# EAGLE design 60W FM PA (EAGLE 9.6.2)
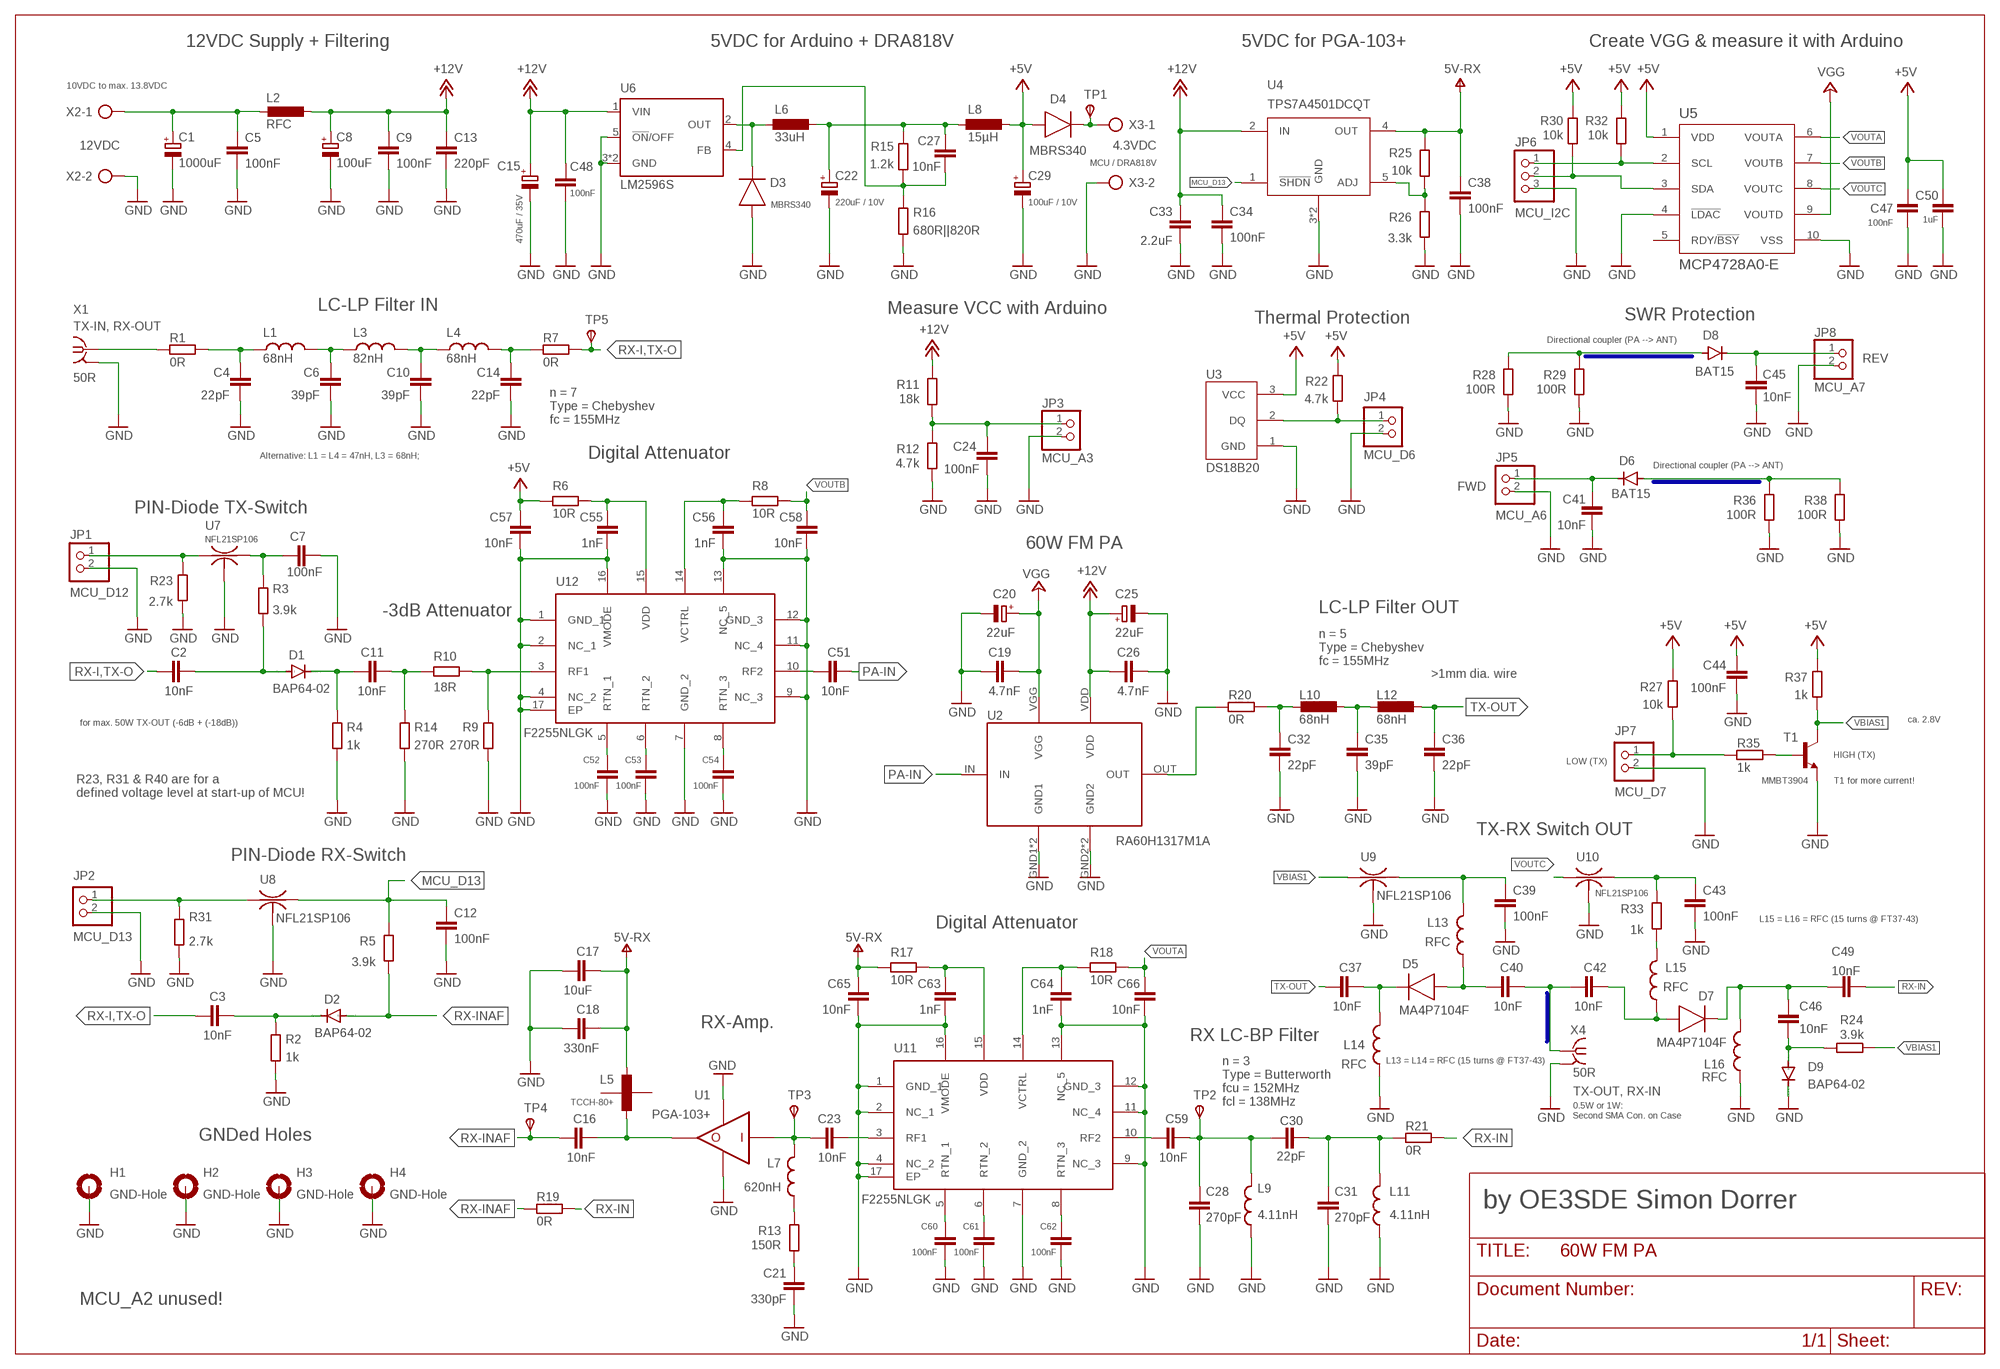
[diagram p0: schematic, sheet 1]

## Parts
C1  1000uF  C-POL_ECAP-10.5MM  [CAPAE1030X1050N]
C2  10nF  C_CHIP-0805(2012-METRIC)  [CAPC2012X110]
C3  10nF  C_CHIP-0805(2012-METRIC)  [CAPC2012X110]
C4  22pF  C_CHIP-0805(2012-METRIC)  [CAPC2012X110]
C5  100nF  C_CHIP-0805(2012-METRIC)  [CAPC2012X110]
C6  39pF  C_CHIP-0805(2012-METRIC)  [CAPC2012X110]
C7  100nF  C_CHIP-0805(2012-METRIC)  [CAPC2012X110]
C8  100uF  C-POL_ECAP-10.5MM  [CAPAE1030X1050N]
C9  100nF  C_CHIP-0805(2012-METRIC)  [CAPC2012X110]
C10  39pF  C_CHIP-0805(2012-METRIC)  [CAPC2012X110]
C11  10nF  C_CHIP-0805(2012-METRIC)  [CAPC2012X110]
C12  100nF  C_CHIP-0805(2012-METRIC)  [CAPC2012X110]
C13  220pF  C_CHIP-0805(2012-METRIC)  [CAPC2012X110]
C14  22pF  C_CHIP-0805(2012-METRIC)  [CAPC2012X110]
C15  470uF / 35V  C-POL_ECAP-10.5MM  [CAPAE1030X1050N]
C16  10nF  C_CHIP-0805(2012-METRIC)  [CAPC2012X110]
C17  10uF  C_CHIP-0805(2012-METRIC)  [CAPC2012X110]
C18  330nF  C_CHIP-0805(2012-METRIC)  [CAPC2012X110]
C19  4.7nF  C_CHIP-0805(2012-METRIC)  [CAPC2012X110]
C20  22uF  CPOL-EUSMCD  [SMC_D]
C21  330pF  C_CHIP-0805(2012-METRIC)  [CAPC2012X110]
C22  220uF / 10V  C-POL_TANTALUM-2917(7343-METRIC)  [CAPMP7343X310N]
C23  10nF  C_CHIP-0805(2012-METRIC)  [CAPC2012X110]
C24  100nF  C_CHIP-0805(2012-METRIC)  [CAPC2012X110]
C25  22uF  CPOL-EUSMCD  [SMC_D]
C26  4.7nF  C_CHIP-0805(2012-METRIC)  [CAPC2012X110]
C27  10nF  C_CHIP-0805(2012-METRIC)  [CAPC2012X110]
C28  270pF  C_CHIP-0805(2012-METRIC)  [CAPC2012X110]
C29  100uF / 10V  C-POL_TANTALUM-2917(7343-METRIC)  [CAPMP7343X310N]
C30  22pF  C_CHIP-0805(2012-METRIC)  [CAPC2012X110]
C31  270pF  C_CHIP-0805(2012-METRIC)  [CAPC2012X110]
C32  22pF  C_CHIP-1206(3216-METRIC)  [CAPC3216X135]
C33  2.2uF  C_CHIP-0805(2012-METRIC)  [CAPC2012X110]
C34  100nF  C_CHIP-0805(2012-METRIC)  [CAPC2012X110]
C35  39pF  C_CHIP-1206(3216-METRIC)  [CAPC3216X135]
C36  22pF  C_CHIP-1206(3216-METRIC)  [CAPC3216X135]
C37  10nF  C_CHIP-1206(3216-METRIC)  [CAPC3216X135]
C38  100nF  C_CHIP-0805(2012-METRIC)  [CAPC2012X110]
C39  100nF  C_CHIP-0805(2012-METRIC)  [CAPC2012X110]
C40  10nF  C_CHIP-1206(3216-METRIC)  [CAPC3216X135]
C41  10nF  C_CHIP-0805(2012-METRIC)  [CAPC2012X110]
C42  10nF  C_CHIP-1206(3216-METRIC)  [CAPC3216X135]
C43  100nF  C_CHIP-0805(2012-METRIC)  [CAPC2012X110]
C44  100nF  C_CHIP-0805(2012-METRIC)  [CAPC2012X110]
C45  10nF  C_CHIP-0805(2012-METRIC)  [CAPC2012X110]
C46  10nF  C_CHIP-0805(2012-METRIC)  [CAPC2012X110]
C47  100nF  C_CHIP-0805(2012-METRIC)  [CAPC2012X110]
C48  100nF  C_CHIP-0805(2012-METRIC)  [CAPC2012X110]
C49  10nF  C_CHIP-0805(2012-METRIC)  [CAPC2012X110]
C50  1uF  C_CHIP-0805(2012-METRIC)  [CAPC2012X110]
C51  10nF  C_CHIP-0805(2012-METRIC)  [CAPC2012X110]
C52  100nF  C_CHIP-0603(1608-METRIC)  [CAPC1608X85]
C53  100nF  C_CHIP-0603(1608-METRIC)  [CAPC1608X85]
C54  100nF  C_CHIP-0603(1608-METRIC)  [CAPC1608X85]
C55  1nF  C_CHIP-0805(2012-METRIC)  [CAPC2012X110]
C56  1nF  C_CHIP-0805(2012-METRIC)  [CAPC2012X110]
C57  10nF  C_CHIP-0805(2012-METRIC)  [CAPC2012X110]
C58  10nF  C_CHIP-0805(2012-METRIC)  [CAPC2012X110]
C59  10nF  C_CHIP-0805(2012-METRIC)  [CAPC2012X110]
C60  100nF  C_CHIP-0603(1608-METRIC)  [CAPC1608X85]
C61  100nF  C_CHIP-0603(1608-METRIC)  [CAPC1608X85]
C62  100nF  C_CHIP-0603(1608-METRIC)  [CAPC1608X85]
C63  1nF  C_CHIP-0805(2012-METRIC)  [CAPC2012X110]
C64  1nF  C_CHIP-0805(2012-METRIC)  [CAPC2012X110]
C65  10nF  C_CHIP-0805(2012-METRIC)  [CAPC2012X110]
C66  10nF  C_CHIP-0805(2012-METRIC)  [CAPC2012X110]
D1  BAP64-02  DIODE-SOD523  [SOD523]
D2  BAP64-02  DIODE-SOD523  [SOD523]
D3  MBRS340  DIODEDO-214AB(SMC)  [DIOM7959X625N]
D4  MBRS340  DIODEDO-214AB(SMC)  [DIOM7959X625N]
D5  MA4P7104F  DIODE_DO-221-AA  [SODFL5336X110]
D6  BAT15  1N4148WS  [SOD-323]
D7  MA4P7104F  DIODE_DO-221-AA  [SODFL5336X110]
D8  BAT15  1N4148WS  [SOD-323]
D9  BAP64-02  DIODE-SOD523  [SOD523]
H1  GND-Hole  MOUNT-PAD-ROUND3.0  [3,0-PAD]
H2  GND-Hole  MOUNT-PAD-ROUND3.0  [3,0-PAD]
H3  GND-Hole  MOUNT-PAD-ROUND3.0  [3,0-PAD]
H4  GND-Hole  MOUNT-PAD-ROUND3.0  [3,0-PAD]
JP1  MCU_D12  PINHD-1X2  [1X02]
JP2  MCU_D13  PINHD-1X2  [1X02]
JP3  MCU_A3  PINHD-1X2  [1X02]
JP4  MCU_D6  PINHD-1X2  [1X02]
JP5  MCU_A6  PINHD-1X2  [1X02]
JP6  MCU_I2C  PINHD-1X3  [1X03]
JP7  MCU_D7  PINHD-1X2  [1X02]
JP8  MCU_A7  PINHD-1X2  [1X02]
L1  68nH  L_CHIP-0805(2012-METRIC)  [INDC2009X120]
L2  RFC  T50-6  [T50-6SMD]
L3  82nH  L_CHIP-0805(2012-METRIC)  [INDC2009X120]
L4  68nH  L_CHIP-0805(2012-METRIC)  [INDC2009X120]
L5  TCCH-80+  [TCCH-80]
L6  33uH  L-EU  [1260]
L7  620nH  L_CHIP-0805(2012-METRIC)  [INDC2009X120]
L8  15µH  L-EU  [1260]
L9  4.11nH  L_CHIP-0805(2012-METRIC)  [INDC2009X120]
L10  68nH  T50-6  [T50-6SMD]
L11  4.11nH  L_CHIP-0805(2012-METRIC)  [INDC2009X120]
L12  68nH  T50-6  [T50-6SMD]
L13  RFC  L_CHIP-1206(3216-METRIC)  [INDC3216X190]
L14  RFC  L_CHIP-1206(3216-METRIC)  [INDC3216X190]
L15  RFC  L_CHIP-1206(3216-METRIC)  [INDC3216X190]
L16  RFC  L_CHIP-1206(3216-METRIC)  [INDC3216X190]
R1  0R  R_CHIP-0805(2012-METRIC)  [RESC2012X65]
R2  1k  R_CHIP-0805(2012-METRIC)  [RESC2012X65]
R3  3.9k  R_CHIP-0805(2012-METRIC)  [RESC2012X65]
R4  1k  R_CHIP-0805(2012-METRIC)  [RESC2012X65]
R5  3.9k  R_CHIP-0805(2012-METRIC)  [RESC2012X65]
R6  10R  R_CHIP-0805(2012-METRIC)  [RESC2012X65]
R7  0R  R_CHIP-0805(2012-METRIC)  [RESC2012X65]
R8  10R  R_CHIP-0805(2012-METRIC)  [RESC2012X65]
R9  270R  R_CHIP-0805(2012-METRIC)  [RESC2012X65]
R10  18R  R_CHIP-0805(2012-METRIC)  [RESC2012X65]
R11  18k  R_CHIP-0805(2012-METRIC)  [RESC2012X65]
R12  4.7k  R_CHIP-0805(2012-METRIC)  [RESC2012X65]
R13  150R  R_CHIP-0805(2012-METRIC)  [RESC2012X65]
R14  270R  R_CHIP-0805(2012-METRIC)  [RESC2012X65]
R15  1.2k  R_CHIP-0805(2012-METRIC)  [RESC2012X65]
R16  680R||820R  R_CHIP-0805(2012-METRIC)  [RESC2012X65]
R17  10R  R_CHIP-0805(2012-METRIC)  [RESC2012X65]
R18  10R  R_CHIP-0805(2012-METRIC)  [RESC2012X65]
R19  0R  R_CHIP-0805(2012-METRIC)  [RESC2012X65]
R20  0R  R_CHIP-1206(3216-METRIC)  [RESC3216X70]
R21  0R  R_CHIP-0805(2012-METRIC)  [RESC2012X65]
R22  4.7k  R_CHIP-0805(2012-METRIC)  [RESC2012X65]
R23  2.7k  R_CHIP-0805(2012-METRIC)  [RESC2012X65]
R24  3.9k  R_CHIP-0805(2012-METRIC)  [RESC2012X65]
R25  10k  R_CHIP-0805(2012-METRIC)  [RESC2012X65]
R26  3.3k  R_CHIP-0805(2012-METRIC)  [RESC2012X65]
R27  10k  R_CHIP-0805(2012-METRIC)  [RESC2012X65]
R28  100R  R_CHIP-0805(2012-METRIC)  [RESC2012X65]
R29  100R  R_CHIP-0805(2012-METRIC)  [RESC2012X65]
R30  10k  R_CHIP-0805(2012-METRIC)  [RESC2012X65]
R31  2.7k  R_CHIP-0805(2012-METRIC)  [RESC2012X65]
R32  10k  R_CHIP-0805(2012-METRIC)  [RESC2012X65]
R33  1k  R_CHIP-0805(2012-METRIC)  [RESC2012X65]
R35  1k  R_CHIP-0805(2012-METRIC)  [RESC2012X65]
R36  100R  R_CHIP-0805(2012-METRIC)  [RESC2012X65]
R37  1k  R_CHIP-0805(2012-METRIC)  [RESC2012X65]
R38  100R  R_CHIP-0805(2012-METRIC)  [RESC2012X65]
T1  MMBT3904  [SOT23]
TP1  TPSTP10SQ  [TP10SQ]
TP2  TPSTP10SQ  [TP10SQ]
TP3  TPSTP10SQ  [TP10SQ]
TP4  TPSTP10SQ  [TP10SQ]
TP5  TPSTP10SQ  [TP10SQ]
U1  PGA-103+  [SOT89]
U2  RA60H1317M1A  [RA60H1317M1A]
U3  DS18B20  DS1810-10  [21-0248A_MXM]
U4  TPS7A4501DCQT  [DCQ6]
U5  MCP4728A0-E  MCP4728A0-E/UNMSOP10_MC_MCH-M  [MSOP10_MC_MCH-M]
U6  LM2596S  [TO263-5]
U7  NFL21SP106  [NFM21C]
U8  NFL21SP106  [NFM21C]
U9  NFL21SP106  [NFM21C]
U10  NFL21SP106  [NFM21C]
U11  F2255NLGK  [QFN50P300X300X100-17N]
U12  F2255NLGK  [QFN50P300X300X100-17N]
X1  TX-IN, RX-OUT  SMA-142-0711-821/826  [J502-ND-142-0711-821/826]
X2  12VDC  AK300/2  [AK300/2]
X3  4.3VDC  AK300/2  [AK300/2]
X4  TX-OUT, RX-IN  SMA-142-0711-821/826  [J502-ND-142-0711-821/826]

## Nets
+5V: C29.1(+) C44.2 C47.2 C50.2 C57.1 D4.1(A) L8.- R6.1 R22.2 R27.1 R30.1 R32.1 R37.1 U3.3(VCC) U5.1(VDD)
+12V: C8.1(+) C9.2 C13.2 C15.1(+) C25.+ C26.1 C33.2 C34.2 C48.2 L2.P$2 R11.2 U2.VDD U4.2(IN) U6.1(VIN)
+24V: C19.2 C20.+ U2.VGG U5.9(VOUTD) ; supply symbol labelled VGG
GND: C1.2(-) C4.2 C5.1 C6.2 C7.1 C8.2(-) C9.1 C10.2 C12.1 C13.1 C14.2 C15.2(-) C17.2 C18.2 C19.1 C20.- C21.1 C22.2(-) C24.1 C25.- C26.2 C28.2 C29.2(-) C31.2 C32.2 C33.1 C34.1 C35.2 C36.2 C38.1 C39.1 C41.2 C43.1 C44.1 C45.2 C47.1 C48.1 C50.1 C52.2 C53.2 C54.2 C55.2 C56.2 C57.2 C58.2 C60.2 C61.2 C62.2 C63.2 C64.2 C65.2 C66.2 D3.1(A) D9.C H1.B3,0(MOUNT) H2.B3,0(MOUNT) H3.B3,0(MOUNT) H4.B3,0(MOUNT) JP1.2 JP2.2 JP3.2 JP4.2 JP5.2 JP6.3 JP7.2 JP8.2 L9.1 L11.1 L14.1 L16.1 R2.2 R4.2 R9.2 R12.1 R14.2 R16.1 R23.2 R26.2 R28.1 R29.1 R31.2 R36.1 R38.1 T1.2(E) U1.2(GND1) U1.2@1(GND2) U2.GND1 U2.GND2 U2.GND3(GND1) U2.GND4(GND2) U3.1(GND) U4.3(GND) U4.6(GND) U5.4(!LDAC) U5.10(VSS) U6.3(GND) U6.5(!ON!/OFF) U6.6(GND) U7.2@1 U7.2@2 U8.2@1 U8.2@2 U9.2@1 U9.2@2 U10.2@1 U10.2@2 U11.1(GND_1) U11.2(NC_1) U11.4(NC_2) U11.7(GND_2) U11.9(NC_3) U11.11(NC_4) U11.12(GND_3) U11.13(NC_5) U11.16(VMODE) U11.17(EP) U12.1(GND_1) U12.2(NC_1) U12.4(NC_2) U12.7(GND_2) U12.9(NC_3) U12.11(NC_4) U12.12(GND_3) U12.13(NC_5) U12.16(VMODE) U12.17(EP) X1.G@1 X1.G@2 X1.G@3 X1.G@4 X2.2 X3.2 X4.G@1 X4.G@2 X4.G@3 X4.G@4
MCU_D13: C12.2 R5.1 U4.1(!SHDN) U8.3
N$1: C23.2 L7.2 TP3.TP(PP) U1.1(IN)
N$2: C16.1 L5.RF-DC U1.3(OUT)
N$3: C4.1 L1.1 R1.1
N$4: C6.1 L1.2 L3.1
N$5: C10.1 L3.2 L4.1
N$6: C24.2 JP3.1 R11.1 R12.2
N$7: C59.2 U11.10(RF2)
N$8: L7.1 R13.2
N$9: C21.2 R13.1
N$10: C3.1 D2.C R2.1
N$11: C23.1 U11.3(RF1)
N$12: C1.1(+) C5.2 L2.P$1 X2.1
N$13: JP6.1 R32.2 U5.2(SCL)
N$14: C14.1 L4.2 R7.2
N$15: JP6.2 R30.2 U5.3(SDA)
N$16: JP2.1 R31.1 U8.1
N$17: R25.2 R26.1 U4.5(ADJ)
N$18: R1.2 X1.1
N$19: C32.1 L10.P$1 R20.1
N$20: C35.1 L10.P$2 L12.P$1
N$21: L15.2 R33.2
N$22: C40.1 C42.2 X4.1
N$23: C28.1 C30.1 C59.1 L9.2 TP2.TP(PP)
N$24: C30.2 C31.1 L11.2 R21.2
N$25: D4.2(C) TP1.TP(PP) X3.1
N$26: R20.2 U2.OUT
N$27: C51.2 U12.10(RF2)
N$28: JP4.1 R22.1 U3.2(DQ)
N$29: C52.1 U12.5(RTN_1)
N$30: C41.1 D6.C JP5.1
N$31: C45.1 D8.C JP8.1
N$32: D8.A R28.2 R29.2
N$33: C37.1 D5.2(C) L14.2
N$34: C42.1 D7.1(A) L15.1
N$35: C40.2 D5.1(A) L13.1
N$36: C53.1 U12.6(RTN_2)
N$37: C46.2 D9.A R24.2
N$38: D3.2(C) L6.+ U6.2(OUT)
N$39: C22.1(+) C27.2 L6.- L8.+ R15.2
N$40: C2.1 D1.A R3.2
N$41: JP1.1 R23.1 U7.1
N$42: C11.2 D1.C R4.1
N$43: R35.1 T1.1(B)
N$44: D6.A R36.2 R38.2
N$45: C54.1 U12.8(RTN_3)
N$46: C27.1 R15.1 R16.2 U6.4(FB)
N$47: C55.1 R6.2 U12.15(VDD)
N$48: C56.1 R8.1 U12.14(VCTRL)
N$49: C11.1 R10.1 R14.1
N$50: C60.1 U11.5(RTN_1)
N$51: C61.1 U11.6(RTN_2)
N$52: C62.1 U11.8(RTN_3)
N$53: C63.1 R17.2 U11.15(VDD)
N$54: C64.1 R18.1 U11.14(VCTRL)
N$55: R9.1 R10.2 U12.3(RF1)
N$56: JP7.1 R27.2 R35.2
N$57: C7.2 R3.1 U7.3
N$58: C43.2 R33.1 U10.3
N$59: C39.2 L13.2 U9.3
PA-IN: C51.1 U2.IN
RX-I,TX-O: C2.2 C3.2 R7.1 TP5.TP(PP)
RX-IN: C49.1 R19.1 R21.1
RX-INAF: C16.2 D2.A R5.2 R19.2 TP4.TP(PP)
RX-INAF1: C46.1 C49.2 D7.2(C) L16.2
TX-OUT: C36.1 C37.2 L12.P$2
V+: C17.1 C18.1 C38.2 C65.1 L5.DC R17.1 R25.1 U4.4(OUT) ; supply symbol labelled 5V-RX
VBIAS1: R24.1 R37.2 T1.3(C) U9.1
VOUTA: C66.1 R18.2 U5.6(VOUTA)
VOUTB: C58.1 R8.2 U5.7(VOUTB)
VOUTC: U5.8(VOUTC) U10.1
Unconnected: L5.NC1 L5.NC2 U5.5(RDY/!BSY)

## Buses
+5V,GND,+24V,N$7,N$13,N$15
B$1

## Notes on the sheet
- 12VDC Supply + Filtering | 5VDC for Arduino + DRA818V | 5VDC for PGA-103+ | Create VGG & measure it with Arduino
- 10VDC to max. 13.8VDC
- MCU / DRA818V
- LC-LP Filter IN | Measure VCC with Arduino
- Thermal Protection | SWR Protection
- Directional coupler (PA --> ANT)
- REV
- 50R
- n = 7
  Type = Chebyshev
  fc = 155MHz
- Alternative: L1 = L4 = 47nH, L3 = 68nH; | Digital Attenuator
- Directional coupler (PA --> ANT)
- FWD
- PIN-Diode TX-Switch
- 60W FM PA
- -3dB Attenuator | LC-LP Filter OUT
- n = 5
  Type = Chebyshev
  fc = 155MHz
- >1mm dia. wire
- ca. 2.8V
- for max. 50W TX-OUT (-6dB + (-18dB))
- HIGH (TX)
- LOW (TX)
- T1 for more current!
- R23, R31 & R40 are for a 
  defined voltage level at start-up of MCU!
- TX-RX Switch OUT
- PIN-Diode RX-Switch
- L15 = L16 = RFC (15 turns @ FT37-43)
- Digital Attenuator
- RX-Amp.
- RX LC-BP Filter
- L13 = L14 = RFC (15 turns @ FT37-43)
- 50R
- n = 3
  Type = Butterworth
  fcu = 152MHz
  fcl = 138MHz
- 0.5W or 1W:
  Second SMA Con. on Case
- GNDed Holes
- by OE3SDE Simon Dorrer
- MCU_A2 unused!

## Library data of the parts
C1 C8 C15 C22 C29 = Capacitor:C-POL: Capacitor Polarised - Generic; CATEGORY: Capacitor
C2-C7 C9-C14 C16-C19 C21 C23 C24 C26-C28 C30-C66 = Capacitor:C: Capacitor - Generic; CATEGORY: Capacitor
C20 C25 = rcl:CPOL-EU: POLARIZED CAPACITOR, European symbol; SPICEPREFIX: C
D1 D2 D9 = diode:DIODE-: DIODE
D3-D5 D7 = Diode:DIODE: Diode Rectifier - Generic; CATEGORY: Diode; SUB-CATEGORY: Rectifier
D6 D8 = Diodes:1N4148WS: DIODE GEN PURP 75V 150MA SOD323F Manufacturer's datasheet <https://www.onsemi.com/pub/Collateral/1N914BWS-D.pdf>; CREATED_BY: PCBLayout.com; DIGIKEY_PART_NUMBER: 1N4148WSFSTR-ND; MANUFACTURER: Diodes Incorporated; MPN: 1N4148WS; PACKAGE: SOD-323
H1-H4 = holes:MOUNT-PAD-ROUND: MOUNTING PAD, round
JP1-JP5 JP7 JP8 = Connector:PINHD-1X2: PIN HEADER; CATEGORY: CONNECTOR; SUB-CATEGORY: PIN-HEADER
JP6 = Connector:PINHD-1X3: PIN HEADER; CATEGORY: CONNECTOR; SUB-CATEGORY: PIN-HEADER
L1 L3 L4 L7 L9 L11 L13-L16 = Inductor:L: Inductor Fixed - Generic; CATEGORY: Inductor; SUB-CATEGORY: Fixed
L2 L10 L12 = Ham Radio:T50-6
L5 = Ham Radio:TCCH-80+
L6 L8 = rcl:L-EU: INDUCTOR, European symbol
R1-R33 R35-R38 = Resistor:R: Resistor Fixed - Generic; CATEGORY: Resistor; SUB-CATEGORY: Fixed
T1 = Transistor:MMBT3904: TRANS NPN 40V 0.2A SOT-23 Manufacturer's datasheet <https://www.onsemi.com/pub/Collateral/PZT3904-D.pdf>; CREATED_BY: PCBLayout.com; DIGIKEY_PART_NUMBER: MMBT3904FSCT-ND; MANUFACTURER: ON Semiconductor; MPN: MMBT3904; PACKAGE: SOT-23-3
TP1-TP5 = testpad:TPS: TEST PIN
U1 = Ham Radio:PGA-103+
U2 = Ham Radio:RA60H1317M1A
U3 = DS18B20:DS1810-10; BUILT_BY: EMA_UL_Team; MANUFACTURER_PART_NUMBER: DS1810-10; REVISION: 2; SOURCELIBRARY: Maxim_2011-05-13; VENDOR: Maxim Integrated Products
U4 = TPS7A4501:TPS7A4501DCQT; DATASHEET_URL: http://www.ti.com/lit/gpn/TPS7A4533; DESCRIPTION: Low-Noise Fast-Transient-Response 1.5-A LDO Regulator; FAMILY_NAME: SINGLE CHANNEL LDO; GENERIC_PART_NUMBER: TPS7A4533; INDUSTRY_STD_PKG_TYPE: SOT-223; MANUFACTURER: Texas Instruments; MANUFACTURER_PART_NUMBER: TPS7A4501DCQT; PACKAGE_DESIGNATOR: DCQ; PIN_COUNT: 6; VENDOR: Texas Instruments
U5 = MCP4728:MCP4728A0-E/UN; BUILT_BY: EMA_Jessica; COPYRIGHT: Copyright (C) 2018 Accelerated Designs. All rights reserved; MANUFACTURER_PART_NUMBER: MCP4728A0-E/UN; SOURCELIBRARY: Microchip_2019-08-23_21; VENDOR: Microchip
U6 = national-semiconductor:LM2596: SIMPLE SWITCHER® Power Converter 150 kHz 3A Step-Down Voltage Regulator Source: http://www.national.com/ds/LM/LM2596.pdf; MF: NATIONAL SEMICONDUCTOR; MPN: LM2596S-ADJ/NOPB; OC_FARNELL: 9494367; OC_NEWARK: 41K3842
U7-U10 = Ham Radio:NFL21SP106
U11 U12 = F2255NLGK:F2255NLGK: Attenuators RF Attenuator 1.1dB 1MHz to 3000MHz Source: Datasheet <https://componentsearchengine.com/Datasheets/1/F2255NLGK.pdf>; DESCRIPTION: Attenuators RF Attenuator 1.1dB 1MHz to 3000MHz; HEIGHT: 1mm; MANUFACTURER_NAME: IDT; MANUFACTURER_PART_NUMBER: F2255NLGK; MOUSER_PART_NUMBER: 972-F2255NLGK; MOUSER_PRICE-STOCK: https://www.mouser.com/Search/Refine.aspx?Keyword=972-F2255NLGK
X1 X4 = con-coax:SMA-: SMA 50 Ohm End Launch Jack Receptacle - Round Contact Johnson Components Source: www.johnsoncomponents.com .. J502-ND.pdf; MF: JOHNSON COMPONENTS; MPN: 142-0711-821; OC_FARNELL: 1019328; OC_NEWARK: 16F3627
X2 X3 = con-ptr500:AK300/2: CONNECTOR; OC_FARNELL: unknown; OC_NEWARK: unknown

## Board
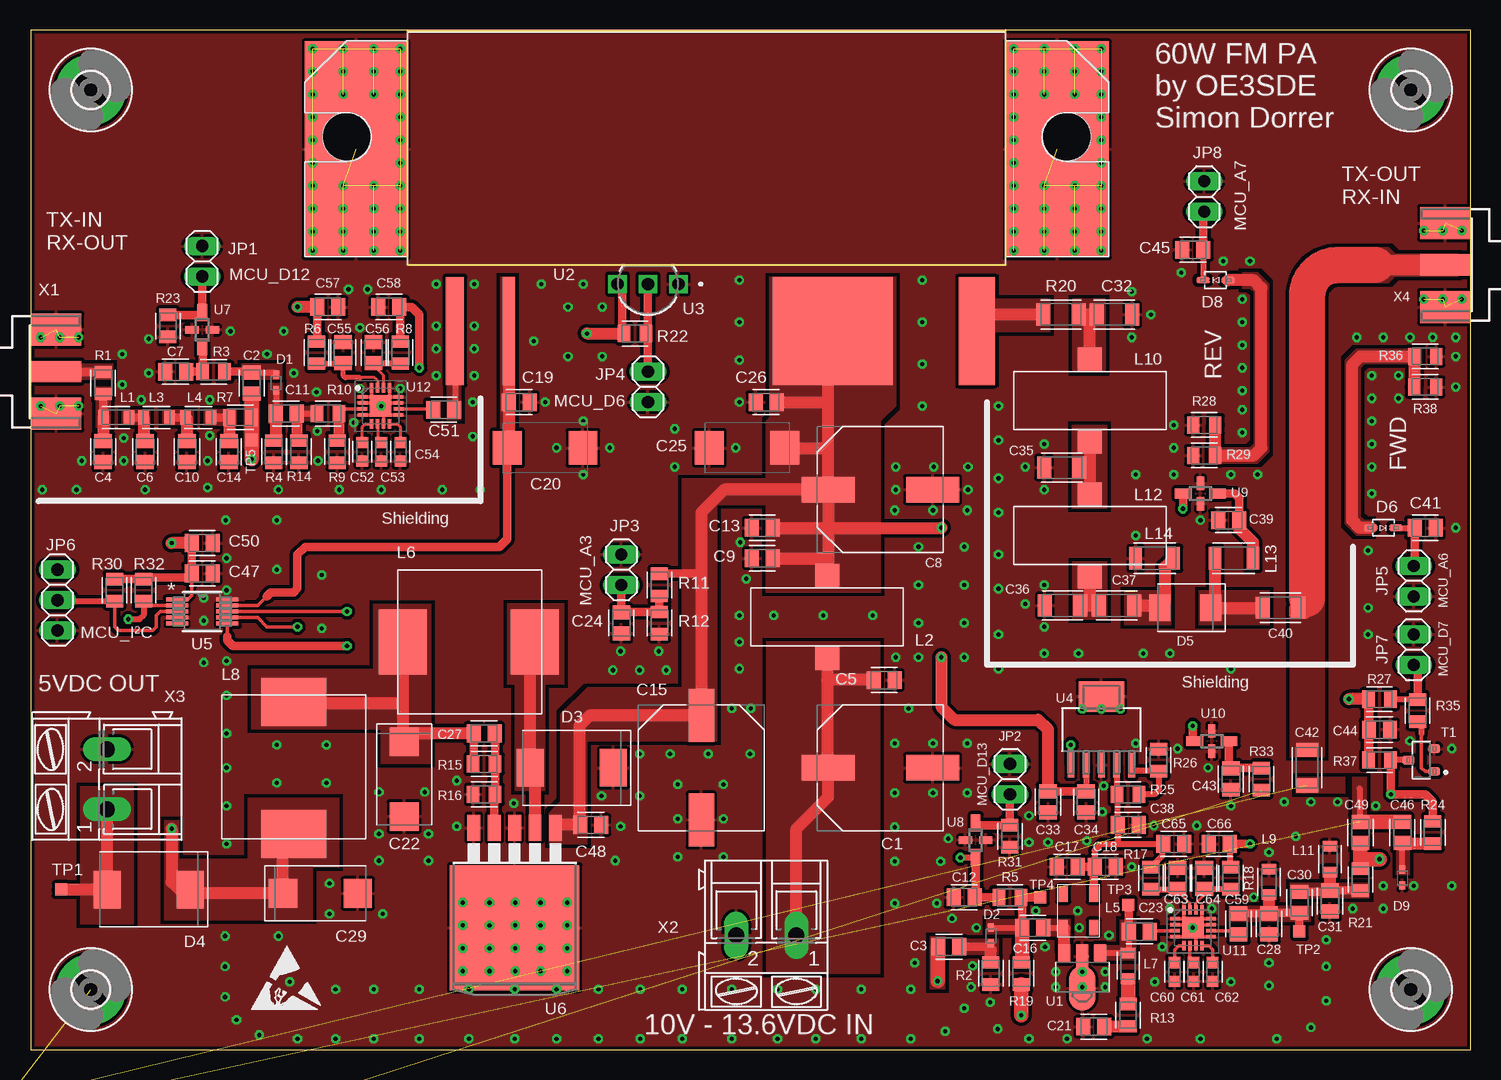
[diagram p1: board, top side]
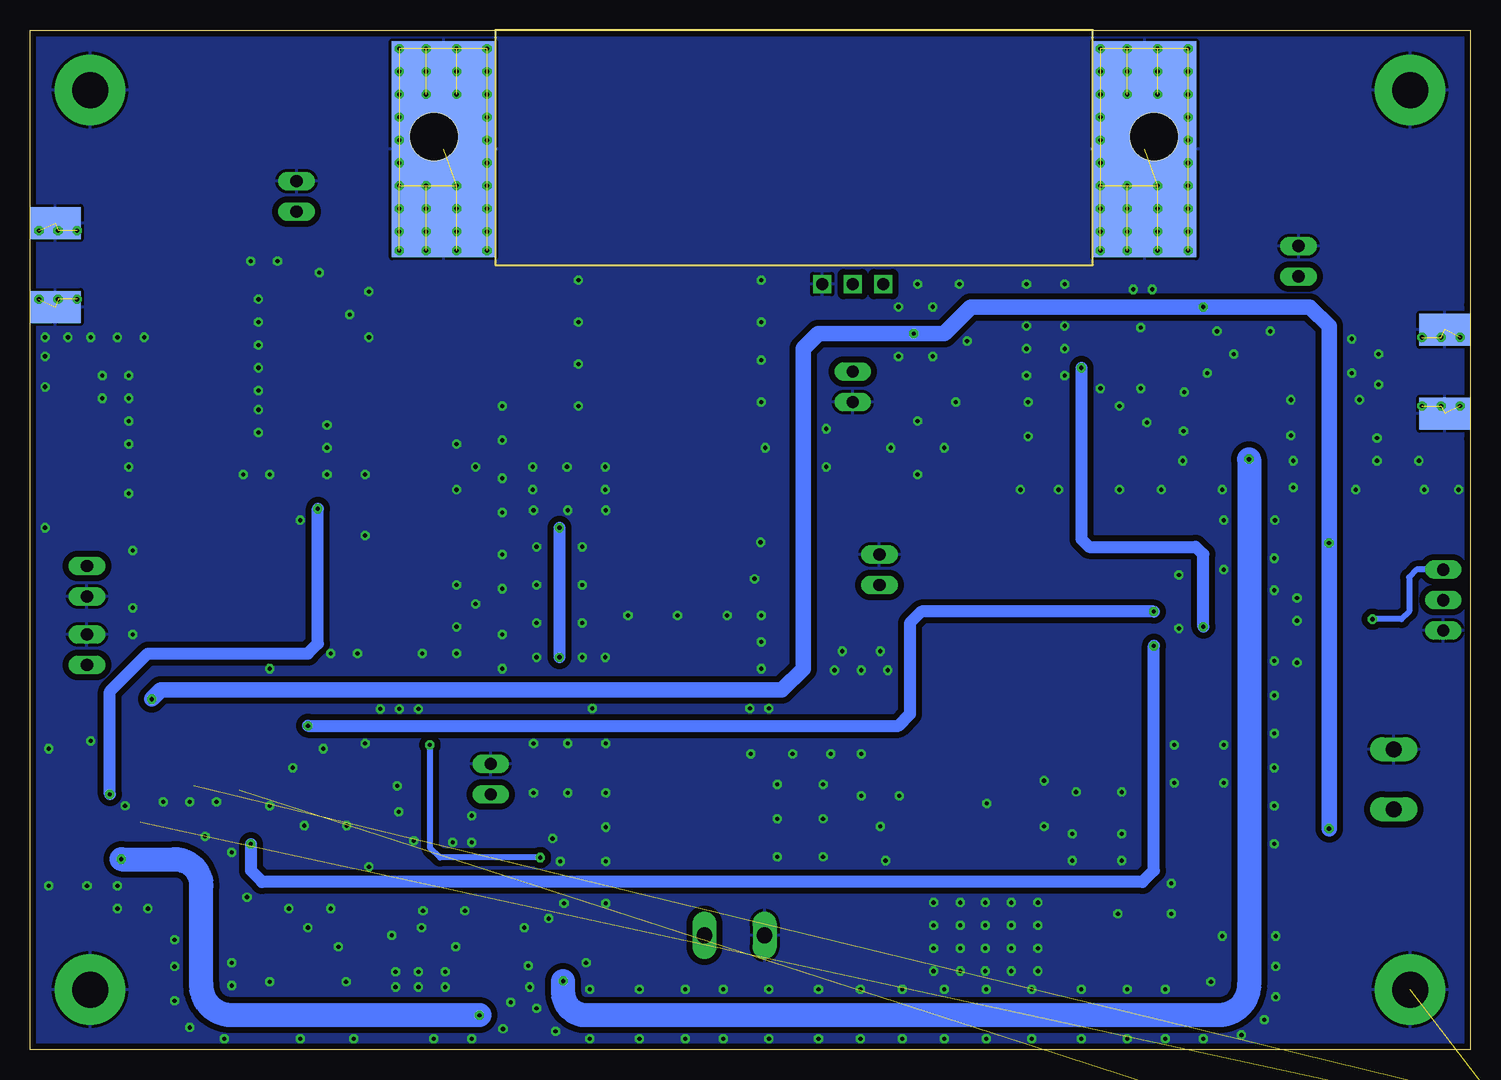
[diagram p2: board, bottom side, seen from below]

Size 120 x 85 mm. Coordinates in mm from the lower left corner, seen from the top.
Outline: 0,0 120,0 120,85 0,85 0,0
Copper layers (1*16): Top 0.035mm / dielectric 1.5mm / Bottom 0.035mm
Design rules "default *": minimum track width 6mil, minimum drill 0.35mm, track to track 0.2mm, track to pad 0.2mm, pad to pad 0.2mm, via to via 0.2mm, smd to smd 6mil, copper to edge 10mil, drill to drill 6mil, minimum pad ring 10mil, minimum via ring 8mil, stop-mask expansion 4mil, vias tented up to drill 0mil, thermal gap 10mil
Milling: 4 lines

### Footprints (pad centres in the part's own frame; a part is rotated, then mirrored left to right if it is on the bottom)
CAPAE1030X1050N = smd 4.416 x 2.115: 1 -4.353,0; 2 4.353,0
CAPC2012X110 = smd 1.165 x 1.465: 1 -0.875,0; 2 0.875,0
SMC_D = smd 2.4 x 2.8: + -3.15,0; - 3.15,0
CAPMP7343X310N = smd 2.368 x 2.404: 1 -3.121,0; 2 3.121,0
CAPC3216X135 = smd 1.165 x 1.815: 1 -1.475,0; 2 1.475,0
CAPC1608X85 = smd 0.921 x 0.97: 1 -0.775,0; 2 0.775,0
SOD523 = smd 0.7 x 0.5: A 0.7,0; C -0.6,0
DIOM7959X625N = smd 2.252 x 3.12: 1 -3.457,0; 2 3.457,0
SODFL5336X110 = smd 1.752 x 2.224: 1 -2.13,0; 2 2.13,0
SOD-323 = smd 1.14 x 0.52: A 1.04,0; C -1.04,0
3,0-PAD = drill 3 pad 5.842: B3,0 0,0
1X02 = drill 1.016 long: 1 -1.27,0; 2 1.27,0
1X03 = drill 1.016 long: 1 -2.54,0; 2 0,0; 3 2.54,0
INDC2009X120 = smd 0.876 x 1.21: 1 -1.067,0; 2 1.067,0
T50-6SMD = smd 2 x 2: P$1 -3.54,0; P$2 3.29,0
TCCH-80 = smd 0.76 x 1.27: DC -1.27,-1.524; NC1 -1.27,1.27; NC2 1.27,-1.524; RF-DC 1.27,1.27
1260 = smd 4 x 5.4: + 5.5,0; - -5.5,0
INDC3216X190 = smd 1.043 x 1.91: 1 -1.584,0; 2 1.584,0
RESC2012X65 = smd 1.031 x 1.42: 1 -0.919,0; 2 0.919,0
RESC3216X70 = smd 1.165 x 1.815: 1 -1.475,0; 2 1.475,0
SOT23 = smd 0.71 x 0.96: 1 -0.95,-1.075; 2 0.95,-1.075; 3 0,1.075
TP10SQ = smd 1 x 1: TP 0,0
SOT89 = smd 1 x 1.5: 1 -1.499,-1.981; 3 1.499,-1.981 | smd 1 x 2: 2 0,-1.727 | smd 2.2 x 3.7: 2@1 0,0.94
RA60H1317M1A = smd 8.6 x 18: GND1 -28.448,-0.508; GND2 29.972,-0.508 | smd 8.6 x 18 bottom: GND3 -28.448,-0.508; GND4 29.972,-0.508 | smd 1.5 x 9: IN -20.23,-15.668 | smd 3 x 9: OUT 23.27,-15.668 | smd 10 x 9: VDD 11.27,-15.668 | smd 1 x 9: VGG -15.73,-15.668 | hole 4: -29.23,0.54; 30.77,0.54
21-0248A_MXM = drill 1.016 pad 1.524 square: 1 -2.54,0; 2 0,0; 3 2.54,0
DCQ6 = smd 0.559 x 2.057: 1 -2.54,-2.959; 2 -1.27,-2.959; 3 0,-2.959; 4 1.27,-2.959; 5 2.54,-2.959 | smd 3.81 x 2.54: 6 0,2.756
MSOP10_MC_MCH-M = smd 1.829 x 0.33: 1 -2.095,1; 2 -2.095,0.5; 3 -2.095,0; 4 -2.095,-0.5; 5 -2.095,-1; 6 2.095,-1; 7 2.095,-0.5; 8 2.095,0; 9 2.095,0.5; 10 2.095,1
TO263-5 = smd 1.067 x 2.159: 1 -3.404,-5.791; 2 -1.702,-5.791; 3 0,-5.791; 4 1.702,-5.791; 5 3.404,-5.791 | smd 10.8 x 10.41: 6 0,2.54
NFM21C = smd 1.4 x 0.8: 1 -1.425,0; 3 1.425,0 | smd 0.6 x 1.1: 2@1 0,-0.85; 2@2 0,0.85
QFN50P300X300X100-17N = smd 0.8 x 0.3: 1 -1.5,0.75; 2 -1.5,0.25; 3 -1.5,-0.25; 4 -1.5,-0.75; 9 1.5,-0.75; 10 1.5,-0.25; 11 1.5,0.25; 12 1.5,0.75 | smd 0.3 x 0.8: 5 -0.75,-1.5; 6 -0.25,-1.5; 7 0.25,-1.5; 8 0.75,-1.5; 13 0.75,1.5; 14 0.25,1.5; 15 -0.25,1.5; 16 -0.75,1.5 | smd 1.8 x 1.8: 17 0,0
J502-ND-142-0711-821/826 = smd 4.191 x 1.778: 1 2.115,0 | smd 4.191 x 2.667: G@1 2.115,3.495; G@2 2.115,-3.495 | smd 4.191 x 2.667 bottom: G@3 2.115,3.495; G@4 2.115,-3.495
AK300/2 = drill 1.321 long: 1 -2.515,0; 2 2.489,0

### Placement (x,y rotation side)
C1  70.8,23.5 0 top
C2  18.41,55.56 270 top
C3  76.52,8.57 180 top
C4  6.03,49.85 270 top
C5  71.12,30.8 180 top
C6  9.53,49.85 270 top
C7  12.06,56.52 0 top
C8  70.8,46.67 0 top
C9  60.96,40.96 0 top
C10  13.02,49.85 270 top
C11  21.27,53.02 180 top
C12  77.79,12.7 0 top
C13  60.96,43.5 0 top
C14  16.51,49.85 270 top
C15  55.88,23.5 270 top
C16  83.5,10.16 180 top
C17  86.36,15.24 180 top
C18  89.53,15.24 0 top
C19  40.7,53.98 180 top
C20  42.86,50.16 0 top
C21  88.58,1.91 0 top
C22  31.11,22.54 270 top
C23  92.39,9.84 180 top
C24  49.21,35.56 90 top
C25  59.69,50.16 180 top
C26  61.28,53.98 180 top
C27  37.78,26.35 180 top
C28  103.19,10.48 270 top
C29  24.13,13.02 0 top
C30  105.73,12.26 90 top
C31  108.27,12.38 270 top
C32  90.3,61.28 0 top
C33  84.77,20.64 90 top
C34  87.95,20.64 90 top
C35  85.92,48.51 180 top
C36  85.98,37.02 180 top
C37  90.49,37.02 180 top
C38  91.44,18.73 180 top
C39  99.82,44.13 0 top
C40  104.14,36.83 180 top
C41  116.2,43.5 0 top
C42  106.36,23.5 90 top
C43  100.01,22.54 90 top
C44  112.39,26.67 180 top
C45  96.84,66.67 180 top
C46  114.3,18.1 270 top
C47  14.29,39.69 180 top
C48  46.67,18.73 180 top
C49  110.81,18.1 90 top
C50  14.29,42.23 180 top
C51  34.42,53.34 180 top
C52  27.62,49.85 270 top
C53  29.21,49.85 270 top
C54  30.8,49.85 270 top
C55  26.04,58.1 90 top
C56  28.57,58.1 90 top
C57  24.77,61.91 0 top
C58  29.84,61.91 180 top
C59  100.65,10.48 270 top
C60  95.31,6.48 270 top
C61  96.9,6.48 270 top
C62  98.49,6.48 270 top
C63  95.57,14.29 90 top
C64  97.79,14.29 90 top
C65  95.25,17.14 0 top
C66  99.06,17.14 180 top
D1  20.45,55.56 90 top
D2  80.01,9.46 90 top
D3  45.09,23.5 180 top
D4  9.84,13.34 180 top
D5  96.2,36.83 180 top
D6  112.71,43.5 180 top
D7  -13.65,-7.62 0 top  (outside the outline)
D8  98.74,64.14 0 top
D9  114.3,14.29 90 top
H1  115,5 0 top
H2  5,5 0 top
H3  5,80 0 top
H4  115,80 0 top
JP1  14.29,65.72 90 top
JP2  81.6,22.54 90 top
JP3  49.21,40.01 90 top
JP4  51.44,55.24 270 top
JP5  115.25,39.05 270 top
JP6  2.22,37.47 270 top
JP7  115.25,33.34 90 top
JP8  97.79,71.12 90 top
L1  7.11,52.7 0 top
L2  66.36,36.2 90 top
L3  10.48,52.7 0 top
L4  13.97,52.7 0 top
L5  87.31,11.43 180 top
L6  36.51,33.97 0 top
L7  91.44,6.99 90 top
L8  21.91,23.5 90 top
L9  103.19,13.97 270 top
L10  88.27,53.98 270 top
L11  108.27,15.88 270 top
L12  88.27,42.74 270 top
L13  100.27,40.96 0 top
L14  93.66,40.96 0 top
L15  -15.24,-15.88 0 top  (outside the outline)
L16  -15.24,-23.5 0 top  (outside the outline)
R1  6.03,55.56 90 top
R2  80.01,6.35 270 top
R3  15.24,56.52 0 top
R4  20.26,49.85 270 top
R5  81.6,12.7 0 top
R6  23.81,58.1 270 top
R7  17.46,52.7 180 top
R8  30.8,58.1 90 top
R9  25.53,49.85 270 top
R10  24.77,53.02 0 top
R11  52.39,38.73 90 top
R12  52.39,35.56 90 top
R13  91.44,2.86 90 top
R14  22.35,49.85 270 top
R15  37.78,23.81 180 top
R16  37.78,21.27 0 top
R17  93.34,14.29 270 top
R18  100.01,14.29 90 top
R19  82.55,6.35 90 top
R20  85.85,61.28 180 top
R21  110.81,14.16 270 top
R22  50.36,59.69 180 top
R23  11.43,60.33 270 top
R24  116.84,18.1 270 top
R25  91.44,21.27 0 top
R26  93.98,24.13 90 top
R27  112.39,29.21 0 top
R28  97.79,52.07 0 top
R29  97.79,49.53 0 top
R30  6.99,38.29 270 top
R31  81.6,17.78 270 top
R32  9.4,38.29 270 top
R33  102.55,22.54 270 top
R35  115.57,28.26 90 top
R36  116.2,57.78 180 top
R37  112.39,24.13 0 top
R38  116.2,55.24 180 top
T1  115.89,24.13 90 top
TP1  2.54,13.34 180 top
TP2  105.73,9.84 0 top
TP3  91.44,12.06 0 top
TP4  84.14,12.7 0 top
TP5  18.41,50.8 0 top
U1  87.63,6.03 180 top
U2  55.56,75.56 0 top
U3  51.44,63.82 180 top
U4  89.22,26.67 0 top
U5  14.29,36.51 0 top
U6  40.32,12.7 180 top
U7  14.29,60.01 270 top
U8  78.74,17.46 270 top
U9  97.47,46.35 0 top
U10  98.42,25.72 0 top
U11  96.84,10.16 0 top
U12  29.15,53.66 0 top
X1  0,56.52 0 top
X2  61.28,9.53 180 top
X3  6.35,22.54 90 top
X4  120,65.41 180 top

### Tracks (layer width: path | path; a pad name or v marks a point on that pad's centre or on a via)
+5V  (via drill 0.35)
  Top 0.3: U5.1 13.06,37.51 13.41,37.86 13.41,39.37 C47.2
  Top 0.7: C50.2 C47.2 | R30.1 R32.1 9.56,39.37 13.41,39.37 | C57.1 23.89,59.02 R6.1 | R22.2 49.31,59.82 49.31,63.4 U3.3
  Top 0.8: R27.1 111.52,29.17 C44.2 111.52,24.17 R37.1
  Top 1: 13.62,13.02 C29.1 21.01,17.1 L8.- | 13.62,13.02 D4.1 | C50.2 v11.75,42.23 | v11.75,18.41 11.75,13.97 12.7,13.02 13.62,13.02 | C57.1 v22.23,61.91 | R27.1 v109.86,29.21 | v46.35,59.69 R22.2
  Bottom 1.3: v109.86,29.21 109.09,29.97 57.34,29.97 55.56,31.75 55.56,58.42 54.29,59.69 v46.35,59.69 43.81,59.69 41.59,61.91 v22.23,61.91 13.34,61.91 11.75,60.33 v11.75,42.23 v11.75,18.41
  pour Top (isolate 0.5, no thermals): 11.11,10.79 23.5,10.79 23.5,15.24 25.72,15.24 25.72,20.95 18.1,20.95 18.1,15.88 11.11,15.88
  pour Top (isolate 0.5, no thermals): 11.11,19.05 11.11,11.43 12.38,11.43 12.38,19.05
+12V  (via drill 0.35)
  Top 0.5: U4.2 C34.2
  Top 0.7: R11.2 52.42,39.69 55.88,39.69 | C34.2 C33.2
  Top 1: C8.1 66.45,43.5 | 66.45,43.5 66.45,40.96 | 66.45,40.96 66.45,39.58 L2.P$2 | C13.2 66.45,43.5 | C9.2 66.45,40.96 | C8.1 66.45,50.16 | 66.45,50.16 66.45,53.98 | 66.45,53.98 66.45,57.88 66.99,58.42 66.99,61.59 66.83,61.44 U2.VDD | C25.+ 66.45,50.16 | C26.1 66.45,53.98 | U6.1 43.97,18.73 C48.2 45.72,18.81 45.72,26.99 46.58,27.85 C15.1 55.88,39.69 55.88,44.77 57.78,46.67 C8.1 | C33.2 84.77,26.67 83.95,27.5 76.96,27.5 75.88,28.57 v75.88,32.7 | 66.45,43.5 v75.88,43.5
  Bottom 1: v75.88,43.5 v75.88,32.7
  pour Top (isolate 0.5, no thermals): 72.07,64.45 72.07,53.66 70.8,52.39 70.8,38.1 61.28,38.1 61.28,52.39 61.59,52.7 61.59,64.45
  pour Top (isolate 0.5, no thermals): 43.18,19.68 43.18,17.14 46.35,17.14 46.35,25.72 57.15,25.72 57.15,30.16 46.35,30.16 44.13,27.94 44.13,20.64
  pour Top (isolate 0.5, no thermals): 68.9,45.4 57.15,45.4 57.15,25.72 54.29,25.72 54.29,47.62 68.9,47.62
+24V
  Top 0.3: U5.9 18.91,37.01 19.68,37.78
  Top 0.7: C20.+ 39.71,42.57 39.05,41.91 22.86,41.91 22.23,41.27 22.23,38.42 21.91,38.1 20,38.1 19.68,37.78
  Top 1: U2.VGG C19.2 39.83,50.28 C20.+
  pour Top (isolate 0.5, no thermals): 39.18,51.75 39.18,64.45 40.32,64.45 40.32,51.75
GND  (via drill 0.35)  (81 unrouted)
  Top 0.3: U11.7 97.09,9.53 | 97.09,9.53 97.09,9.91 U11.17 | U11.9 97.2,9.41 97.09,9.53 | U11.11 97.09,10.41 97,10.32 | 97,10.32 U11.17 | U11.12 97.54,10.91 | 97.54,10.91 96.64,10.91 | 96.64,10.91 96.52,10.79 97,10.32 | U11.13 97.59,10.96 97.54,10.91 | U11.1 96.14,10.91 | 96.14,10.91 96.64,10.91 | U11.16 96.09,10.96 96.14,10.91 | U11.2 96.59,10.41 U11.17 | U11.4 96.97,9.41 97.09,9.53 | U12.16 28.4,54.41 | 28.4,54.41 28.9,53.91 | 28.9,53.91 U12.17 | U12.2 28.9,53.91 | U12.1 28.4,54.41 | U12.13 29.9,54.41 | 29.9,54.41 29.5,54.01 | 29.5,54.01 U12.17 | U12.12 29.9,54.41 | U12.11 29.59,53.91 29.5,54.01 | U12.9 29.9,52.91 U12.17 | U12.7 29.4,53.02 | 29.4,53.02 29.4,53.41 U12.17 | U12.4 29.28,52.91 29.4,53.02
  other vias: 118.75,57.78 118.75,55.24 113.98,56.2 111.76,56.2 111.76,54.29 111.76,52.39 111.76,50.48 111.76,48.58 111.76,46.35 118.75,43.5 110.49,59.37 112.71,59.37 114.94,59.37 118.75,59.37 116.84,59.37 119.25,62.55 116.08,62.55 117.67,62.55 116.08,68.26 117.67,68.26 119.25,68.26 95.89,64.77 91.76,63.18 93.34,61.28 91.76,59.37 100.97,62.55 100.97,60.64 100.97,58.74 100.97,56.83 100.97,54.93 100.97,53.34 100.97,51.44 95.25,52.07 95.25,50.16 99.38,65.72 101.6,65.72 102.23,47.94 100.01,47.94 84.45,50.48 84.45,46.67 82.87,48.58 84.45,35.24 84.45,38.73 82.87,37.15 92.08,47.94 92.08,42.86 97.47,44.13 95.25,47.94 118.43,25.08 114.94,25.72 115.25,13.65 112.71,13.65 118.43,13.65 104.46,20.64 105.41,17.78 95.57,25.08 100.01,20.32 92.08,25.53 93.6,18.67 87.63,28.38 90.81,28.38 89.22,28.38 89.41,21.97 83.19,19.49 89.28,19.81 91.76,15.24 87.25,11.56 75.82,15.68 75.5,12.19 72.01,21.4 72.01,15.68 72.01,12.19 79.95,3.94 78.36,5.21 76.77,10.92 76.45,17.59 83.19,17.27 84.77,17.27 85.41,6.48 89.53,6.48 89.53,5.21 85.41,5.21 87.63,6.48 87.63,5.21 86.36,0.89 93.03,0.89 107.95,9.14 103.19,7.24 103.19,16.45 97.16,18.67 96.84,10.16 98.42,11.75 94.3,8.57 94.93,11.75 88.01,17.4 100.01,5.65 93.66,5.65 81.92,83.44 84.45,83.44 89.22,83.44 87,83.44 0.83,59.37 2.41,59.37 4,59.37 0.83,53.66 2.41,53.66 4,53.66 81.92,81.53 84.45,81.53 89.22,81.53 87,81.53 81.92,79.63 84.45,79.63 89.22,79.63 87,79.63 81.92,77.72 89.22,77.72 81.92,75.82 89.22,75.82 89.22,73.91 81.92,73.91 81.92,72.01 84.45,72.01 89.22,72.01 87,72.01 81.92,70.1 84.45,70.1 89.22,70.1 87,70.1 81.92,68.2 84.45,68.2 89.22,68.2 87,68.2 81.92,66.61 84.45,66.61 87,66.61 89.22,66.61 23.5,83.44 26.04,83.44 30.8,83.44 28.57,83.44 23.5,81.53 26.04,81.53 30.8,81.53 28.57,81.53 23.5,79.63 26.04,79.63 30.8,79.63 28.57,79.63 23.5,77.72 30.8,77.72 23.5,75.82 30.8,75.82 30.8,73.91 23.5,73.91 23.5,72.01 26.04,72.01 30.8,72.01 28.57,72.01 23.5,70.1 26.04,70.1 30.8,70.1 28.57,70.1 23.5,68.2 26.04,68.2 30.8,68.2 28.57,68.2 23.5,66.61 26.04,66.61 28.57,66.61 30.8,66.61 80.64,53.66 80.64,50.8 80.64,47.62 80.64,44.77 80.64,41.27 80.64,38.42 80.64,34.61 80.64,31.75 84.45,33.02 87.31,33.02 92.71,33.02 94.93,33.02 111.44,41.59 111.44,36.83 111.44,34.61 100.01,31.75 43.81,50.16 48.26,50.16 46.04,52.39 46.04,47.94 58.74,50.16 53.66,51.75 75.25,48.58 78.11,46.67 72.07,46.67 75.18,44.96 59.63,39.24 52.32,33.21 49.15,33.21 53.91,19.24 57.72,19.24 50.74,24.64 47.56,21.15 50.74,21.15 49.15,18.61 35.5,18.61 35.5,22.42 40.26,20.51 36,6.54 38.23,6.54 40.39,6.54 44.7,6.54 42.48,6.54 36,8.45 38.23,8.45 40.39,8.45 44.7,8.45 42.48,8.45 36,10.35 38.23,10.35 40.39,10.35 44.7,10.35 42.48,10.35 36,12.26 38.23,12.26 40.39,12.26 44.7,12.26 42.48,12.26 33.15,17.97 29.02,17.97 29.02,21.46 32.83,21.46 24.89,11.3 24.89,13.84 29.34,11.3 29.02,15.75 33.15,15.75 48.7,15.75 98.11,23.5 53.66,48.58 59.05,53.98 42.86,53.98 59.05,64.14 59.05,60.64 59.05,57.47 46.04,63.82 42.55,63.82 16.26,44.13 16.32,40.96 16.32,38.29 14.41,37.66 14.41,35.75 4.25,49.09 7.75,49.09 14.73,49.09 23.94,49.09 16.64,59.88 28.07,63.37 26.48,63.37 27.43,60.2 21.08,59.88 29.21,53.66 30.8,55.12 27.43,55.12 9.84,56.39 9.84,59.25 0.95,46.67 3.81,46.67 9.53,46.67 14.73,46.86 20.64,46.67 25.72,46.67 29.21,46.67 34.29,46.67 37.47,46.67 36.83,53.98 36.83,51.12 7.62,57.98 7.62,55.44 7.75,50.99 14.92,54.17 9.21,54.17 23.81,54.8 23.88,51.56 14.92,51.18 21.91,56.39 19.68,57.98 108.9,20.64 106.68,20.64 112.08,20.32 112.71,11.75 110.17,11.75 101.92,12.7 89.85,9.53 87.38,10.16 78.8,10.16 78.49,6.99 84.52,8.57 83.76,11.56 26.92,52.26 59.12,42.29 72.07,32.7 73.98,32.7 61.91,36.2 66.04,36.2 70.17,36.2 59.05,31.75 58.42,28.45 73.15,28.45 24.26,35.12 24.26,39.56 14.41,32.26 97.47,0.89 103.82,0.89 107.95,6.92 107.95,4.06 106.68,1.84 80.58,1.71 83.19,0.89 103.19,5.33 77.79,3.43 76.2,1.52 73.34,0.89 16.19,6.92 16.19,4.38 17.14,2.48 19.05,1.21 22.23,0.89 69.22,0.89 73.66,7.24 73.34,5.02 69.22,5.02 65.41,5.02 62.23,5.02 58.42,5.02 54.29,5.02 50.8,5.02 47.31,5.02 43.81,5.02 40.32,5.02 36.51,5.02 32.38,5.02 28.57,5.02 25.4,5.02 16.19,9.46 20.64,9.46 21.59,5.65 20.51,44.13 20.51,40.01 20.51,25.4 20.51,22.23 24.64,25.4 24.64,22.23 16.32,32.38 16.32,29.53 16.32,26.35 16.32,17.14 16.32,20.32 16.32,23.5 113.98,54.29 36.96,60.33 36.96,58.42 36.96,56.2 36.96,63.82 33.78,63.82 33.78,60.33 33.78,58.42 33.78,56.2 65.41,0.89 62.23,0.89 58.42,0.89 54.29,0.89 50.8,0.89 47.31,0.89 43.81,0.89 40.32,0.89 36.51,0.89 32.38,0.89 28.57,0.89 25.4,0.89 74.3,64.14 74.3,60.64 74.3,57.15 74.3,53.66 72.07,48.58 78.11,48.58 78.04,44.96 72.01,44.96 73.98,35.56 73.98,41.91 73.98,38.73 77.79,41.91 77.79,38.73 77.79,35.56 77.79,32.7 47.62,61.91 44.77,61.91 44.77,57.78 47.62,57.78 41.91,59.05 48.51,31.62 52.96,31.62 50.74,31.62 53.91,22.1 57.72,22.1 53.91,16.07 57.72,16.07 53.28,24.64 56.45,24.64 59.94,24.64 59.05,36.2 59.05,33.97 60.01,28.45 72.01,18.54 72.01,25.53 78.04,25.53 78.04,21.4 75.18,25.53 75.18,21.4
  pour Top (isolate 0.3, rank 2): 0,0 0,85 120,85 120,0
  pour Bottom (isolate 0.5, rank 2): 0,0 0,85 120,85 120,0
  pour Top: 0.64,46.67 4.13,46.67 4.13,45.09 0.64,45.09
  pour Top: 9.21,46.67 12.7,46.67 12.7,45.09 9.21,45.09
  pour Top: 17.14,46.67 20.64,46.67 20.64,45.09 17.14,45.09
  pour Top: 25.72,46.67 29.21,46.67 29.21,45.09 25.72,45.09
  pour Top: 36.51,50.8 36.51,54.29 38.1,54.29 38.1,50.8
  pour Top: 79.06,50.48 79.06,53.98 80.64,53.98 80.64,50.48
  pour Top: 109.86,38.42 109.86,41.91 111.44,41.91 111.44,38.42
  pour Top: 111.44,34.92 111.44,31.43 109.86,31.43 109.86,34.92
  pour Top: 103.19,31.43 100.65,31.43 100.65,33.02 103.19,33.02
  pour Top: 95.89,31.43 92.39,31.43 92.39,33.02 95.89,33.02
  pour Top: 87.63,31.43 84.14,31.43 84.14,33.02 87.63,33.02
  pour Top: 80.64,34.92 80.64,31.43 79.06,31.43 79.06,34.92
  pour Top: 79.06,38.1 79.06,41.59 80.64,41.59 80.64,38.1
  pour Top: 79.06,44.45 79.06,47.94 80.64,47.94 80.64,44.45
  pour Top (isolate 0.15, no thermals): 17.78,38.42 17.78,34.61 10.79,34.61 10.79,38.42
  pour Top: 33.97,46.67 37.47,46.67 37.47,45.09 33.97,45.09
MCU_D13  (via drill 0.35)
  Top 0.5: U4.1 v86.68,25.4 | v77.47,16 77.5,16.04 U8.3
  Top 0.7: U8.3 78.74,12.78 C12.2 R5.1
  Bottom 0.5: v77.47,16 85.85,16 86.68,16.83 v86.68,25.4
N$1
  Top 0.5: U1.1 89.17,8.05 L7.2 91.52,8.13 C23.2
  Top 0.7: TP3.TP 91.52,11.99 C23.2
  pour Top (isolate 0.3, no thermals): 88.58,8.7 90.81,8.7 90.81,10.79 92.08,10.79 92.08,7.43 88.58,7.43
N$2
  Top 0.5: C16.1 L5.RF-DC
  Top 1: U1.3 86.13,10.07 L5.RF-DC
  pour Top (isolate 0.3, no thermals): 83.82,10.86 83.82,9.46 86.68,9.46 86.68,10.86
N$3
  Top 0.7: R1.1 6.04,54.63 L1.1
  Top 1: L1.1 6.04,50.73 C4.1
  pour Top (isolate 0.3, no thermals): 5.4,55.24 5.4,51.88 6.67,51.88 6.67,55.24
N$4
  Top 0.7: L1.2 L3.1
  Top 1: L3.1 9.41,50.84 C6.1
  pour Top (isolate 0.3, no thermals): 7.62,53.34 9.91,53.34 9.91,52.07 7.62,52.07
N$5
  Top 0.7: L3.2 L4.1
  Top 1: L4.1 13.02,52.59 C10.1
  pour Top (isolate 0.3, no thermals): 10.99,53.34 13.53,53.34 13.53,52.07 10.99,52.07
N$6
  Top 0.7: R11.1 R12.2 49.26,36.48 C24.2 JP3.1
N$7
  Top 0.3: U11.10 100.34,9.91 C59.2
N$8
  Top 0.7: 91.44,5.4 L7.1
  Top 1: R13.2 91.44,4.45
  Top 1.2: 91.44,4.45 91.44,5.4
N$9
  Top 1: R13.1 91.41,1.91 C21.2
N$10
  Top 0.5: 80.01,8.26 D2.C
  Top 0.7: D2.C 79.72,8.57 C3.1
  Top 1: R2.1 80.01,8.26
  pour Top (isolate 0.3, no thermals): 76.77,9.21 76.77,7.94 80.64,7.94 80.64,9.21
N$11
  Top 0.3: U11.3 93.33,9.91 C23.1
N$12
  Top 1: X2.1 63.79,18.39 66.45,21.05 C1.1 66.36,23.59 66.36,30.8 | L2.P$1 66.36,30.8 | C5.2 66.36,30.8
  pour Top (isolate 0.5, no thermals): 61.28,33.97 61.28,6.35 70.8,6.35 70.8,33.97
N$13  (via drill 0.35)
  Top 0.3: U5.2 9.76,37.01 R32.2
  Top 0.5: R32.2 9.4,36.23 9.05,35.88 v8.13,35.88
  Bottom 0.5: JP6.1 4.45,40.01 5.08,39.37 5.08,36.51 5.71,35.88 v8.13,35.88
N$14
  Top 0.7: L4.2 R7.2
  Top 1: R7.2 16.54,50.76 C14.1
  pour Top (isolate 0.3, no thermals): 14.41,53.34 14.41,52.07 17.14,52.07 17.14,53.34
N$15
  Top 0.3: R30.2 6.99,35.24 7.3,34.92 10.16,34.92 10.48,35.24 10.48,36.2 10.79,36.51 U5.3
  Top 0.5: R30.2 2.32,37.37
  Top 0.7: 2.32,37.37 JP6.2
N$16
  Top 0.7: JP2.1 R31.1 78.93,18.7 U8.1
N$17
  Top 0.5: R25.2 93.66,21.27 93.98,21.59 R26.1 91.79,23.21 91.76,23.18 U4.5
N$18
  Top 0.7: R1.2 2.15,56.48 X1.1
  pour Top (isolate 0.3, no thermals): 6.86,57.15 0.95,57.15 0.95,55.88 6.86,55.88
N$19
  Top 1: R20.1 C32.1 88.27,60.72 L10.P$1
  pour Top (isolate 1.5, no thermals): 86.8,56.52 89.6,56.52 89.6,62.55 86.8,62.55
N$20
  Top 1: L10.P$2 88.27,48.58 | 88.27,48.58 L12.P$1 | C35.1 87.45,48.58 88.27,48.58
  pour Top (isolate 1.5, no thermals): 86.8,52.07 89.66,52.07 89.66,45.09 86.8,45.09
N$21  (1 unrouted)
N$22
  Top 0.5: C40.1 105.09,36.83 105.09,36.2 106.36,36.2
  Top 1: C40.1 106.36,37.58
  Top 1.7: X4.1 112.08,65.41
  Top 3: 106.36,37.58 106.36,62.87 arc-90 108.9,65.41 112.08,65.41
  pour Top (isolate 2, no thermals): 113.67,64.45 113.67,66.36 113.16,66.87 109.09,66.87 arc90 104.9,62.67 104.9,35.88 107.82,35.88 107.82,62.93 arc-90 108.84,63.94 113.16,63.94
  pour Top (isolate 1, no thermals): 113.67,66.36 120.02,66.36 120.02,64.45 113.67,64.45
  pour Top (isolate 1.5, no thermals): 107.82,35.88 104.9,35.88 104.9,24.45 107.82,24.45
N$23
  Top 0.7: 103.19,12.38 L9.2 | TP2.TP C30.1 103.22,11.38 C28.1 C59.1
  Top 1: C28.1 103.19,12.38
  pour Top (isolate 0.3, no thermals): 99.82,11.94 99.82,10.67 106.68,10.67 106.68,11.94
N$24
  Top 0.7: L11.2 108.27,14.29 | C30.2 108.14,13.13 C31.1 110.79,13.26 R21.2
  Top 1: 108.27,14.29 C31.1
  pour Top (isolate 0.3, no thermals): 104.9,13.84 104.9,12.64 111.57,12.64 111.57,13.84
N$25
  Top 1: TP1.TP D4.2 6.39,19.99 X3.1
  pour Top (isolate 0.5, no thermals): 8.57,10.48 8.57,21.91 4.13,21.91 4.13,10.48
N$26
  Top 1: R20.2 78.74,61.28 78.42,60.96 78.42,59.69 78.74,59.37 78.83,59.47 U2.OUT
  pour Top (isolate 1.5, no thermals): 84.9,62.61 84.9,59.82 80.33,59.82 80.33,55.44 77.41,55.44 77.41,64.33 80.33,64.33 80.33,62.61
N$27
  Top 0.3: U12.10 33.47,53.41 C51.2
N$28
  Top 0.7: U3.2 51.44,59.85 | 51.44,59.85 R22.1 | JP4.1 51.44,59.85
N$29
  Top 0.25: C52.1 27.62,51.88 27.9,52.16 U12.5
N$30
  Top 0.5: D6.C C41.1
  Top 0.7: C41.1 115.33,40.4 JP5.1
N$31
  Top 0.5: C45.1 97.71,64.14 D8.C
  Top 0.7: C45.1 97.71,69.77 JP8.1
N$32
  Top 1: D8.A 101.92,64.14 102.55,63.5 102.55,50.16 101.92,49.53 R29.2 R28.2
  pour Top (isolate 0.3, no thermals): 100.97,64.77 100.97,63.5 101.6,63.5 101.92,63.18 101.92,50.48 101.6,50.16 98.11,50.16 98.11,48.9 102.23,48.9 103.19,49.85 103.19,63.82 102.23,64.77
N$33
  Top 1: C37.1 93.88,37.02 D5.2 94.07,36.92 94.49,37.34 94.49,40.2 L14.2
  pour Top (isolate 1.5, no thermals): 91.12,38.23 91.12,35.43 95.06,35.43 95.06,38.23
N$34  (2 unrouted)
  Top 0.5: 106.38,22.04 106.09,21.75
  Top 0.7: 106.09,21.75 C42.1
  pour Top (isolate 0.3, no thermals): 105.41,22.67 105.41,21.4 109.54,21.4 109.54,22.67
N$35
  Top 1: D5.1 98.68,36.83 L13.1 | 98.74,36.83 C40.2
  pour Top (isolate 1.5, no thermals): 97.35,38.23 97.35,35.43 103.25,35.43 103.25,38.23
N$36
  Top 0.25: C53.1 28.96,50.87 28.9,50.94 U12.6
N$37
  Top 0.5: D9.A C46.2
  Top 1: C46.2 114.34,17.18 R24.2
  pour Top (isolate 0.3, no thermals): 113.79,17.78 113.79,14.61 114.94,14.61 114.94,17.78
N$38
  Top 1: U6.2 42.02,23.1 D3.2 41.63,33.59 L6.+
  pour Top (isolate 0.5, no thermals): 40.32,21.59 42.86,21.59 42.86,30.48 44.45,30.48 44.45,37.15 39.69,37.15 39.69,30.48 40.32,30.48
N$39
  Top 0.7: C27.2 36.91,23.86 R15.2
  Top 1: C27.2 31.8,26.35 C22.1 31.01,25.77 31.01,28.89 | L6.- 31.01,28.89 | L8.+ 22.01,28.89 31.01,28.89
  pour Top (isolate 0.5, no thermals): 33.34,36.83 33.34,23.81 29.21,23.81 29.21,26.67 18.41,26.67 18.41,31.75 28.57,31.75 28.57,37.15 33.34,37.15
N$40
  Top 0.5: C2.1 20.27,56.44 D1.A
  Top 0.7: C2.1 18.41,56.52 R3.2
  pour Top (isolate 0.3, no thermals): 17.53,55.88 20.95,55.88 20.95,57.15 17.53,57.15
N$41
  Top 0.7: JP1.1 U7.1 14.29,61.24 R23.1
N$42
  Top 0.5: D1.C 20.45,53.07 C11.2
  Top 1: C11.2 20.4,50.91 R4.1
  pour Top (isolate 0.3, no thermals): 20.95,55.56 20.95,52.2 19.81,52.2 19.81,55.56
N$43
  Top 0.3: 115.89,26.35 115.89,23.5 116.2,23.18 T1.1
  Top 0.5: R35.1 115.89,27.02 115.89,26.35
N$44
  Top 1: D6.A 110.72,43.5 110.08,44.13 110.08,57.06 110.81,57.78 R36.2 R38.2
  pour Top (isolate 0.3, no thermals): 111.76,44.13 111.76,42.86 110.49,42.86 109.54,43.81 109.54,57.47 110.49,58.42 115.89,58.42 115.89,57.15 111.12,57.15 110.81,56.83 110.81,44.45 111.12,44.13
N$45
  Top 0.25: U12.8 30.52,52.16 30.8,51.88 C54.1
N$46
  Top 0.7: U6.4 38.62,21.19 R16.2 R15.1 38.7,26.31 C27.1
N$47
  Top 0.25: 27.43,56.01 28.65,56.01 28.9,55.76 U12.15
  Top 0.4: 27.43,56.01 26.23,56.01 26.04,56.2 C55.1
  Top 0.5: R6.2 26.04,57.18 C55.1
N$48
  Top 0.25: U12.14 29.4,56.2 28.57,57.02 C56.1
  Top 0.5: C56.1 30.8,57.23 R8.1
N$49
  Top 0.5: C11.1 R10.1
  Top 0.9: C11.1 22.15,50.97 R14.1
  pour Top (isolate 0.3, no thermals): 21.59,53.66 24.32,53.66 24.32,52.39 21.59,52.39
N$50
  Top 0.3: C60.1 95.31,8.32 95.66,8.66 U11.5
N$51
  Top 0.3: U11.6 96.59,7.57 C61.1
N$52
  Top 0.3: U11.8 98.15,8.66 98.49,8.32 C62.1
N$53
  Top 0.25: U11.15 96.59,12.19 95.57,13.21 C63.1
  Top 0.5: R17.2 95.52,13.37 C63.1
N$54
  Top 0.25: U11.14 97.09,12.19 97.79,12.89 C64.1
  Top 0.5: C64.1 99.97,13.41
  Top 0.7: 99.97,13.41 R18.1
N$55
  Top 0.3: U12.3 26.07,53.41 R10.2
  Top 0.9: R10.2 25.68,50.92 R9.1
N$56
  Top 0.5: R27.2 115.54,29.21 R35.2
  Top 0.7: JP7.1 115.57,31.75 R35.2
N$57
  Top 0.7: C7.2 R3.1 14.32,58.55 U7.3
N$58
  Top 0.7: U10.3 99.85,23.58 C43.2 100.06,23.46 R33.1
N$59
  Top 0.7: U9.3 100.33,46.35 100.7,45.99 C39.2
  Top 1: C39.2 100.7,43.45 101.85,42.3 L13.2
PA-IN
  Top 0.5: C51.1 35.37,53.42 35.37,59.86 U2.IN
  pour Top (isolate 0.3, no thermals): 34.67,56.83 34.67,52.51 35.88,52.51 35.88,56.83
RX-I,TX-O  (via drill 0.35)
  Top 1: TP5.TP 18.41,52.67 R7.1
  Top 1.2: C2.2 TP5.TP v18.41,49.21 | v75.56,5.71 75.56,8.49 arc-90 C3.2
  Bottom 2: v75.56,5.71 75.56,4.76 arc-90 73.66,2.86 20.95,2.86 arc-90 18.41,5.4 v18.41,49.21
  pour Top (isolate 0.3, no thermals): 17.78,55.24 19.05,55.24 19.05,50.16 17.78,50.16
  pour Top (isolate 0.3, no thermals): 74.93,9.4 74.93,5.08 76.2,5.08 76.2,9.4
RX-IN  (via drill 0.35)
  Top 1: C49.1 110.81,16.51 | 110.81,15.56 R21.1
  Top 1.2: 110.81,16.51 110.81,15.56 111.12,15.88 v112.39,15.88 | R19.1 v82.55,2.86
  Bottom 2: v82.55,2.86 103.19,2.86 arc90 105.73,5.4 105.73,13.65 arc-90 107.95,15.88 v112.39,15.88
RX-INAF
  Top 0.5: D2.A C16.2
  Top 0.7: C16.2 82.63,12.59 R5.2 TP4.TP
  Top 1: 82.55,7.43 R19.2
  Top 1.2: C16.2 82.63,7.51 82.55,7.43
  pour Top (isolate 0.3, no thermals): 83.19,9.65 83.19,10.79 79.63,10.79 79.63,9.65
RX-INAF1  (2 unrouted)
  Top 0.5: 110.73,21.76 110.73,19.05
  Top 1: 110.73,19.05 C49.2
  Top 1.2: C46.1 C49.2
  pour Top (isolate 0.3, no thermals): 110.11,22.67 110.11,18.41 111.32,18.41 111.32,22.67
TX-OUT
  Top 1: C36.1 88.27,37.02 | 88.27,37.02 C37.2 | L12.P$2 88.27,37.02
  pour Top (isolate 1.5, no thermals): 86.8,40.64 86.8,35.88 89.73,35.88 89.73,40.64
V+
  Top 0.5: U4.4 90.49,21.3 R25.1 90.52,18.78 C38.2 90.56,17.22 90.49,17.14 | C18.1 88.66,15.56 88.66,16.59 89.22,17.14 90.49,17.14 | 90.49,17.14 C65.1 94.3,17.07 94.3,16.16 R17.1
  Top 0.7: C17.1 C18.1 | L5.DC 88.58,15.48 88.66,15.56
VBIAS1  (via drill 0.35)
  Top 0.5: T1.3 R37.2
  Top 0.7: U9.1 96.05,45.12 v96.01,45.09 | R37.2 113.35,24.1 v113.35,21.27 116.2,21.27 116.84,20.64 R24.1
  Bottom 1: v113.35,21.27 113.35,29.84 110.17,33.02 96.84,33.02 96.01,33.85 v96.01,45.09
VOUTA  (via drill 0.35)
  Top 0.3: 16.38,34.42 U5.6
  Top 0.5: C66.1 99.94,15.28 R18.2
  Top 0.7: C66.1 v101.6,17.14 | v26.35,33.66 16.83,33.66 16.38,34.1 16.38,34.42
  Bottom 1: v101.6,17.14 101.6,14.92 100.65,13.97 27.3,13.97 26.35,14.92 v26.35,33.66
VOUTB  (via drill 0.35)
  Top 0.3: U5.7 18.91,36.01 19.68,35.24 v22.23,35.24
  Top 0.7: R8.2 30.8,61.91 C58.1 31.75,61.91 32.38,61.28 v32.38,56.83
  Bottom 1: v32.38,56.83 32.38,42.55 31.75,41.91 22.86,41.91 22.23,41.27 v22.23,35.24
VOUTC  (via drill 0.35)
  Top 0.3: U5.8 v26.35,36.51
  Top 0.7: U10.1 96.84,25.88 v96.84,26.99
  Bottom 1: v26.35,36.51 45.72,36.51 46.67,35.56 46.67,27.94 47.62,26.99 v96.84,26.99

### Text on the board
tNames: 60W FM PA / by OE3SDE / Simon Dorrer | TX-OUT / RX-IN | MCU_A7 | TX-IN / RX-OUT | MCU_D12 | REV | MCU_D6 | FWD | Shielding | MCU_A3 | MCU_A6 | MCU_I²C | MCU_D7 | 5VDC OUT | Shielding | MCU_D13 | 10V - 13.6VDC IN